# Altium schematic sheet Triac.SchDoc
size A3; SheetNumber: 1; SheetTotal: 3
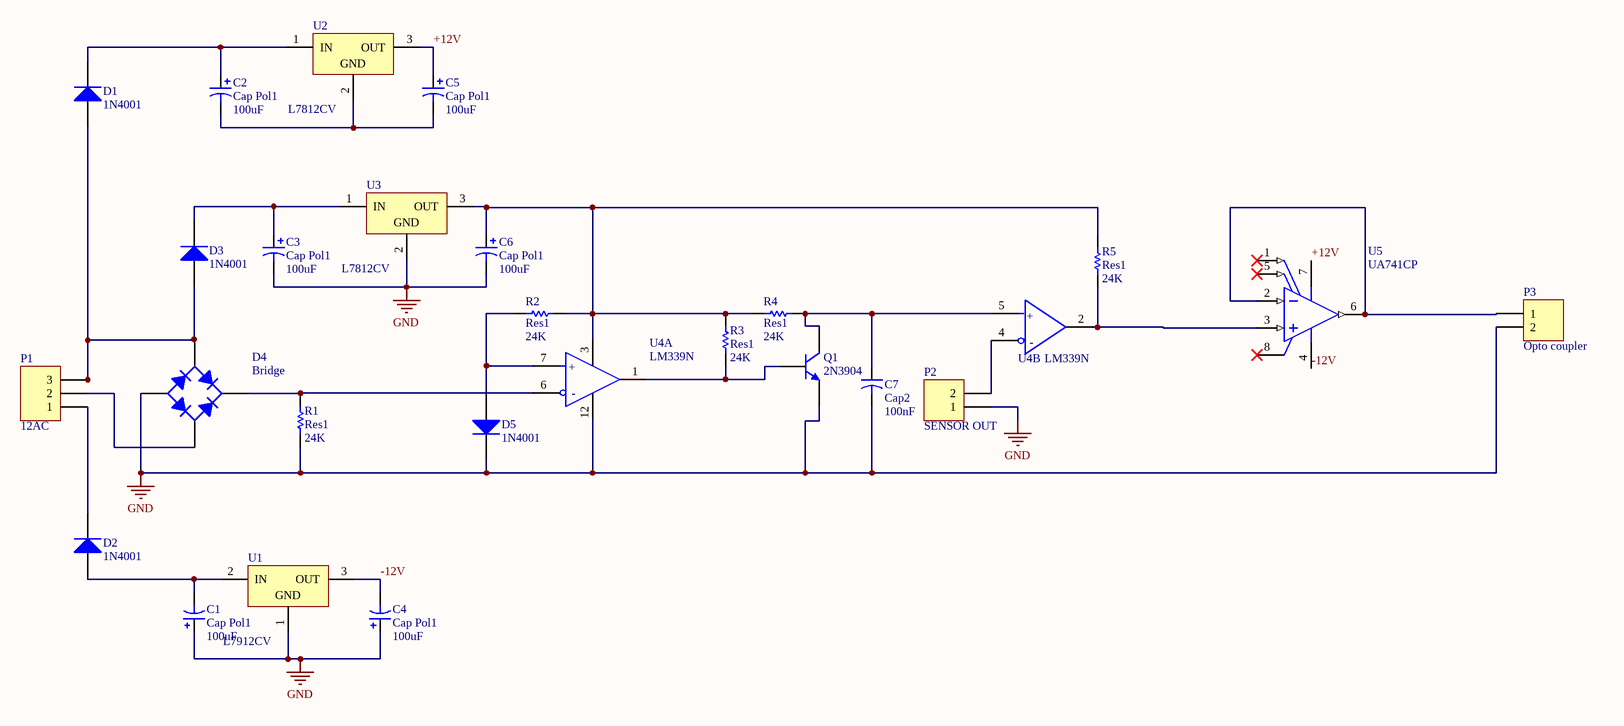
[diagram p0: Triac.SchDoc]

## Parts
C1  Cap Pol1  value 100uF  [RB7.6-15]
C2  Cap Pol1  value 100uF  [RB7.6-15]
C3  Cap Pol1  value 100uF  [RB7.6-15]
C4  Cap Pol1  value 100uF  [RB7.6-15]
C5  Cap Pol1  value 100uF  [RB7.6-15]
C6  Cap Pol1  value 100uF  [RB7.6-15]
C7  Cap2  value 100nF  [CAPR5-4X5]
D1  1N4001  [DO-41]
D2  1N4001  [DO-41]
D3  1N4001  [DO-41]
D4  Bridge  [D-38]
D5  1N4001  [DO-41]
P1  12AC  [HDR1X3]
P2  SENSOR OUT  [HDR1X2]
P3  Opto coupler  [HDR1X2]
Q1  2N3904  [ONSC-TO-92-3-29-11]
R1  Res1  value 24K  [AXIAL-0.3]
R2  Res1  value 24K  [AXIAL-0.3]
R3  Res1  value 24K  [AXIAL-0.3]
R4  Res1  value 24K  [AXIAL-0.3]
R5  Res1  value 24K  [AXIAL-0.3]
U1  L7912CV  [TO-220]
U2  L7812CV  [TO220]
U3  L7812CV  [TO220]
U4  LM339N  [FP-N0014A-MFG]  (parts A,B of 4)
U5  UA741CP  [P0008A]

## Nets
GND: C1.1 C3.2 C4.1 C6.2 C7.2 D4.3(A) D5.2(K) P2.1 P3.2 Q1.1(C) R1.1 U1.1(GND) U3.2(GND) U4.12(GND)
+12V: C5.1 U2.3(OUT) U5.7(VCC+)
-12V: C4.2 U1.3(OUT) U5.4(VCC-)
NetC1_2: C1.2 D2.1(A) U1.2(IN)
NetC2_1: C2.1 D1.2(K) U2.1(IN)
NetC2_2: C2.2 C5.2 U2.2(GND)
NetC3_1: C3.1 D3.2(K) U3.1(IN)
NetC6_1: C6.1 R2.1 R3.1 R4.1 R5.2 U3.3(OUT) U4.3(VCC)
NetC7_1: C7.1 Q1.3(E) R4.2 U4.5(2IN+)
NetD1_1: D1.1(A) D3.1(A) D4.4(C) P1.3
NetD2_2: D2.2(K) P1.1
NetD4_1: D4.1(K) R1.2 U4.6(1IN-)
NetD4_2: D4.2(C) P1.2
NetD5_1: D5.1(A) R2.2 U4.7(1IN+)
NetP2_2: P2.2 U4.4(2IN-)
NetP3_1: P3.1 U5.2(IN-) U5.6(OUT)
NetQ1_2: Q1.2(B) R3.2 U4.1(1OUT)
NetR5_1: R5.1 U4.2(2OUT) U5.3(IN+)

Not connected (* = marked no-connect by the designer): U5 1(OFFSET_N1)* 5(OFFSET_N2)* 8(NC)*

## Notes on the sheet
- (in symbol CMP-0055-00143-4, part A) +; -
- (in symbol CMP-0055-00143-4, part B) +; -

## Library data of the parts
C1-C6 = Cap Pol1: Polarized Capacitor (Radial); Published: 8-Jun-2000; LatestRevisionDate: 17-Jul-2002; LatestRevisionNote: Re-released for DXP Platform.; PackageReference: RB7.6-15; Publisher: Altium Limited; PackageDescription: Polarized Capacitor (Radial); 2 Leads
C7 = Cap2: Capacitor; Published: 23-Sep-2002; PackageReference: CAPR5-4X5; Publisher: Altium Limited; PackageDescription: Capacitor; 2 Leads
D1-D3 D5 = Diode 1N4001: 1 Amp General Purpose Rectifier; Published: 8-Jun-2000; LatestRevisionDate: 17-Jul-2002; LatestRevisionNote: Re-released for DXP Platform.; DatasheetVersion: 1998; PackageVersion: Aug-1999; PackageReference: DO-41; Publisher: Altium Limited; PackageDescription: Diode, Axial; Body 5.2 x 2.7 mm (LxDia. max), Lead Dia. 0.86 mm (max); Code_JEDEC: DO-204-AL; ComponentLink1Description: Manufacturer Link; ComponentLink1URL: http://www.fairchildsemi.com/; ComponentLink2Description: Datasheet; ComponentLink2URL: http://www.fairchildsemi.com/ds/1N%2F1N4001.pdf
D4 = Bridge1: Full Wave Diode Bridge; Published: 8-Jun-2000; LatestRevisionDate: 29-May-2009; LatestRevisionNote: Sch pins A & K swapped.; DatasheetVersion: E2732B; PackageReference: D-38; Publisher: Altium Limited; PackageDescription: Bridge Rectifier; 4 Terminals; Body 9.4 x 9.4 mm (typ); Pitch 5.08 mm
P1 = Header 3: Header, 3-Pin; LatestRevisionDate: 17-Jul-2002; LatestRevisionNote: Re-released for DXP Platform.; Publisher: Altium Limited
P2 P3 = Header 2: Header, 2-Pin; LatestRevisionDate: 17-Jul-2002; LatestRevisionNote: Re-released for DXP Platform.; Publisher: Altium Limited
Q1 = NPN: NPN Bipolar Transistor; Published: 8-Jun-2000; LatestRevisionDate: 17-Jul-2002; LatestRevisionNote: Re-released for DXP Platform.; PackageReference: TO-226-AA; Publisher: Altium Limited; PackageDescription: TO, Flat Index; 3 In-Line, Axial Leads; Body Dia. 4.8mm; Leads 0.55 x 0.51 mm (max); Code_JEDEC: TO-226-AA
R1-R5 = Res1: Resistor; Published: 8-Jun-2000; LatestRevisionDate: 17-Jul-2002; LatestRevisionNote: Re-released for DXP Platform.; PackageReference: AXIAL-0.3; Publisher: Altium Limited; PackageDescription: Axial Device, Thru-Hole; 2 Leads; 0.3 in Pin Spacing
U1 = CMP-0244-00457-1: Negative Voltage Regulator, -12V, 3-Pin TO-220; PackageReference: TO-220; PackageVersion: 2011; PackageDescription: TO, Thru-Hole, Vertical, Heatsink Mounted; 3 In-Line Leads; Pitch 2.54 mm; ComponentLink1Description: Manufacturer URL; ComponentLink2URL: http://www.st.com/internet/com/TECHNICAL_RESOURCES/TECHNICAL_LITERATURE/DATASHEET/CD00000450.pdf; ComponentLink2Description: Datasheet; ComponentLink1URL: http://www.st.com; DatasheetVersion: 1/11/2011
U2 U3 = CMP-0244-00450-1: Positive Voltage Regulator, 12V, 3-Pin TO-220; PackageDescription: TO, Thru-Hole, Vertical, Heatsink Mounted; 3 In-Line Leads; Pitch 2.54 mm; ComponentLink3URL: http://www.st.com/internet/com/TECHNICAL_RESOURCES/TECHNICAL_LITERATURE/PACKAGE_INFORMATION/CD00004649.pdf; ComponentLink1URL: http://www.st.com; ComponentLink2Description: Datasheet; ComponentLink3Description: Package Specification; ComponentLink2URL: http://www.st.com/internet/com/TECHNICAL_RESOURCES/TECHNICAL_LITERATURE/DATASHEET/CD00000444.pdf; DatasheetVersion: 16/11/2011; PackageVersion: ver3.0; PackageReference: TO220; ComponentLink1Description: Manufacturer URL
U4 = CMP-0055-00143-4: IC QUAD DIFF COMPARATOR 14-DIP; Power Dissipation: 1.05kW; Response Time: 1.3us; Max Input Current: 250nA; Max Supply Current: 500uA; Output Current: 20mA; Output Type: TTL; Max Dual Supply Voltage: 15V; Voltage Gain: 106.02dB; Min Supply Voltage: 2V; Max Power Dissipation: 1.05W; Quiescent Current: 2.5mA; Nominal Supply Current: 2mA; Input Offset Voltage (Vos): 5mV; Number of Channels: 4; Output Current per Channel: 6mA; Max Supply Voltage: 30V; Min Dual Supply Voltage: 1V; Dual Supply Voltage: 9V; REACH SVHC: No SVHC; Max Operating Temperature: 70°C; Case/Package: PDIP; Weight: 0.032734oz; Radiation Hardening: No; Min Operating Temperature: 0°C; Number of Pins: 14; Contact Plating: Gold; Package Quantity: 25; Lead Free: Lead Free; Height: 4.57mm; Packaging: Rail/Tube; Input Bias Current: 250nA; Number of Elements: 4; Mount: Through Hole; Width: 6.35mm; Length: 19.3mm
U5 = CMP-0017-00973-2: General-Purpose Operational Amplifier, 7 to 36 V, 0 to 70 degC, 8-pin DIP (P8), Pb-Free (RoHS); Manufacturer: Texas Instruments; Iq per channel(Max)(mA): 2.8; Number of Channels: 1; Total Supply Voltage(Min)(+5V is 5, +/-5V is 10): 7; IIB(Max)(pA): 800000; Slew Rate(Typ)(V/us): 0.5; Total Supply Voltage(Max)(+5V is 5, +/-5V is 10): 36; Vio (25C)(Max)(mV): 6; CMRR(Min)(dB): 70; Sub Family: General Purpose Amplifier, High Supply Voltage Amplifier (>=30V); PackageVersion: 4040082/E, 04/2010; PackageReference: P0008A; ComponentLink1URL: http://www.ti.com/; Mounting Technology: Through Hole; ComponentLink1Description: Manufacturer URL; GBW(Typ)(MHz): 1; ComponentLink2Description: Datasheet; ComponentLink2URL: http://www.ti.com/lit/ds/symlink/ua741.pdf; PartNumber: UA741CP; Code_JEDEC: MS-001; ComponentLink3Description: Package Specification; DatasheetVersion: SLOS094B; ComponentLink3URL: http://www.ti.com/litv/pdf/mpdi001b; PackageDescription: 8-Pin Plastic In-Line, Body 9.59 x 6.35 mm, Pitch 2.54 mm; Eco-Plan: Pb-Free (RoHS)